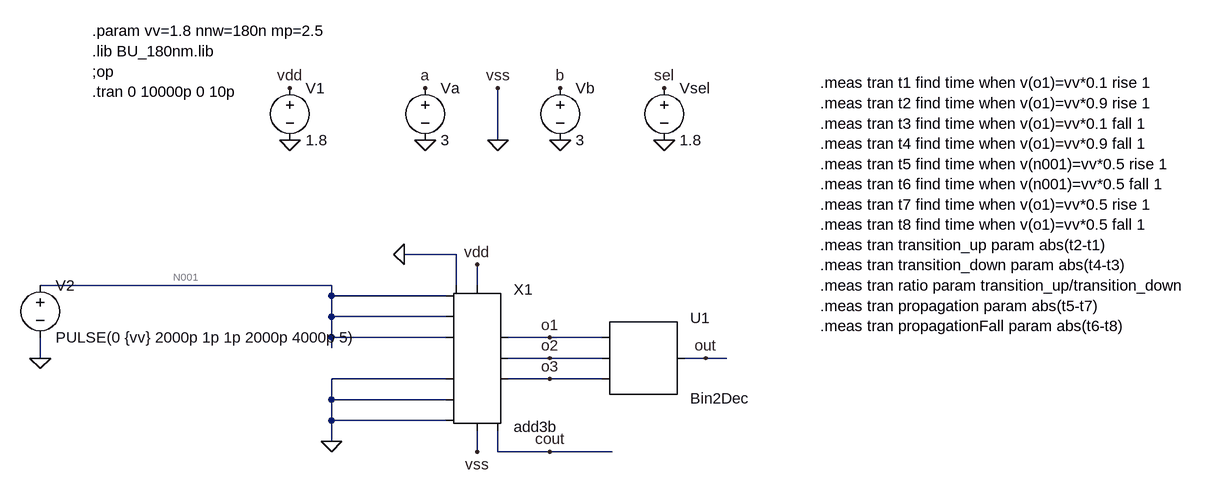
[diagram p0: schematic add3b_test_delai.asc]
add3b_test_delai.asc, the LTspice schematic file:
Version 4
SHEET 1 1596 680
WIRE 464 -16 464 -96
WIRE 400 160 320 160
WIRE 208 208 -240 208
WIRE 400 208 400 160
WIRE 432 208 432 176
WIRE 208 224 208 208
WIRE 384 224 208 224
WIRE 208 256 208 224
WIRE 384 256 208 256
WIRE 208 288 208 256
WIRE 384 288 208 288
WIRE 544 288 480 288
WIRE 624 288 544 288
WIRE 208 304 208 288
WIRE -240 320 -240 288
WIRE 544 320 480 320
WIRE 624 320 544 320
WIRE 784 320 752 320
WIRE 816 320 784 320
WIRE 384 352 208 352
WIRE 544 352 480 352
WIRE 624 352 544 352
WIRE 208 384 208 352
WIRE 384 384 208 384
WIRE 208 416 208 384
WIRE 384 416 208 416
WIRE 208 448 208 416
WIRE 432 464 432 432
WIRE 464 464 464 432
WIRE 544 464 464 464
WIRE 640 464 544 464
FLAG 784 320 out
FLAG 144 -16 0
FLAG 352 -16 0
FLAG 560 -16 0
FLAG 352 -96 a
FLAG 560 -96 b
FLAG 720 -16 0
FLAG 720 -96 sel
FLAG 320 160 0
FLAG 544 352 o3
FLAG 544 320 o2
FLAG 544 288 o1
FLAG 544 464 cout
FLAG 144 -96 vdd
FLAG 432 176 vdd
FLAG 432 464 vss
FLAG 464 -16 0
FLAG 464 -96 vss
FLAG -240 320 0
FLAG 208 448 0
SYMBOL Bin2Dec 688 320 R0
SYMATTR InstName U1
SYMATTR SpiceLine Vhigh={vv}
SYMBOL /voltage 144 -112 R0
SYMATTR InstName V1
SYMATTR Value 1.8
SYMBOL /voltage 352 -112 R0
SYMATTR InstName Va
SYMATTR Value 3
SYMBOL /voltage 560 -112 R0
SYMATTR InstName Vb
SYMATTR Value 3
SYMBOL /voltage 720 -112 R0
SYMATTR InstName Vsel
SYMATTR Value 1.8
SYMBOL add3b 432 320 R0
SYMATTR InstName X1
SYMBOL /voltage -240 192 R0
SYMATTR InstName V2
SYMATTR Value PULSE(0 {vv} 2000p 1p 1p 2000p 4000p 5)
TEXT -160 -184 Left 2 !.param vv=1.8 nnw=180n mp=2.5\n.lib BU_180nm.lib\n;op\n.tran 0 10000p 0 10p
TEXT 960 -104 Left 2 !.meas tran t1 find time when v(o1)=vv*0.1 rise 1\n.meas tran t2 find time when v(o1)=vv*0.9 rise 1\n.meas tran t3 find time when v(o1)=vv*0.1 fall 1\n.meas tran t4 find time when v(o1)=vv*0.9 fall 1\n.meas tran t5 find time when v(n001)=vv*0.5 rise 1\n.meas tran t6 find time when v(n001)=vv*0.5 fall 1\n.meas tran t7 find time when v(o1)=vv*0.5 rise 1\n.meas tran t8 find time when v(o1)=vv*0.5 fall 1\n.meas tran transition_up param abs(t2-t1)\n.meas tran transition_down param abs(t4-t3)\n.meas tran ratio param transition_up/transition_down\n.meas tran propagation param abs(t5-t7)\n.meas tran propagationFall param abs(t6-t8)

The netlist it stands for:
* add3b_test_delai.asc
XU1 o1 o2 o3 out Bin2Dec Vhigh={vv}
V1 vdd 0 1.8
Va a 0 3
Vb b 0 3
Vsel sel 0 1.8
XX1 vdd N001 N001 N001 0 0 0 0 o1 o2 o3 cout 0 add3b
V2 N001 0 PULSE(0 {vv} 2000p 1p 1p 2000p 4000p 5)
.param vv=1.8 nnw=180n mp=2.5
.lib BU_180nm.lib
;op
.tran 0 10000p 0 10p
.meas tran t1 find time when v(o1)=vv*0.1 rise 1
.meas tran t2 find time when v(o1)=vv*0.9 rise 1
.meas tran t3 find time when v(o1)=vv*0.1 fall 1
.meas tran t4 find time when v(o1)=vv*0.9 fall 1
.meas tran t5 find time when v(n001)=vv*0.5 rise 1
.meas tran t6 find time when v(n001)=vv*0.5 fall 1
.meas tran t7 find time when v(o1)=vv*0.5 rise 1
.meas tran t8 find time when v(o1)=vv*0.5 fall 1
.meas tran transition_up param abs(t2-t1)
.meas tran transition_down param abs(t4-t3)
.meas tran ratio param transition_up/transition_down
.meas tran propagation param abs(t5-t7)
.meas tran propagationFall param abs(t6-t8)
.lib BIN2DEC.sub
.backanno
.end

* Results of the author's LTspice run, read from the files saved beside the schematic
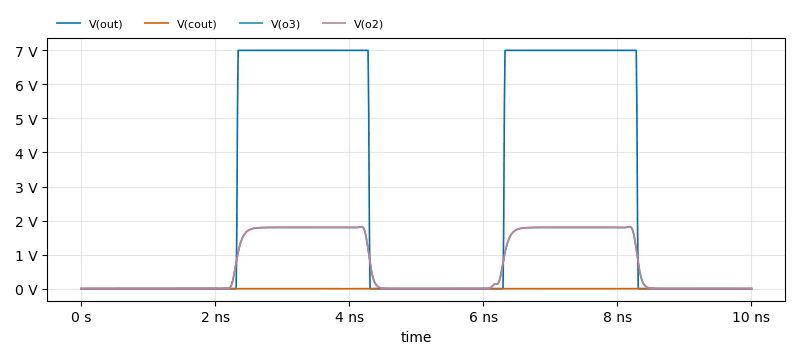
[diagram p1: Transient Analysis of add3b_test_delai.asc, plotted from the saved traces]
* Transient Analysis, 1 run:
*   V(out): min 0 V, max 7 V, average 2.768 V, rms 4.393 V, last 0 V
*   V(cout): min -4.351 mV, max 5.134 mV, average 2.633 µV, rms 324.2 µV, last 2.852 µV
*   V(o3): min 5.58 µV, max 1.821 V, average 712.5 mV, rms 1.11 V, last 5.981 µV
*   V(o2): min 5.58 µV, max 1.821 V, average 712.5 mV, rms 1.11 V, last 5.981 µV
* From the log:
*   t1: time=2.25589e-09 at 2.25589e-09
*   t2: time=2.44562e-09 at 2.44562e-09
*   t3: time=4.38119e-09 at 4.38119e-09
*   t4: time=4.24171e-09 at 4.24171e-09
*   t5: time=2.0005e-09 at 2.0005e-09
*   t6: time=4.0015e-09 at 4.0015e-09
*   t7: time=2.32645e-09 at 2.32645e-09
*   t8: time=4.30066e-09 at 4.30066e-09
*   transition_up: abs(t2-t1)=1.89726e-10
*   transition_down: abs(t4-t3)=1.3948e-10
*   ratio: transition_up/transition_down=1.36023
*   propagation: abs(t5-t7)=3.25952e-10
*   propagationfall: abs(t6-t8)=2.99155e-10